# Altium schematic sheet C-01 CPU PWR.SchDoc
size 513 x 386 mm
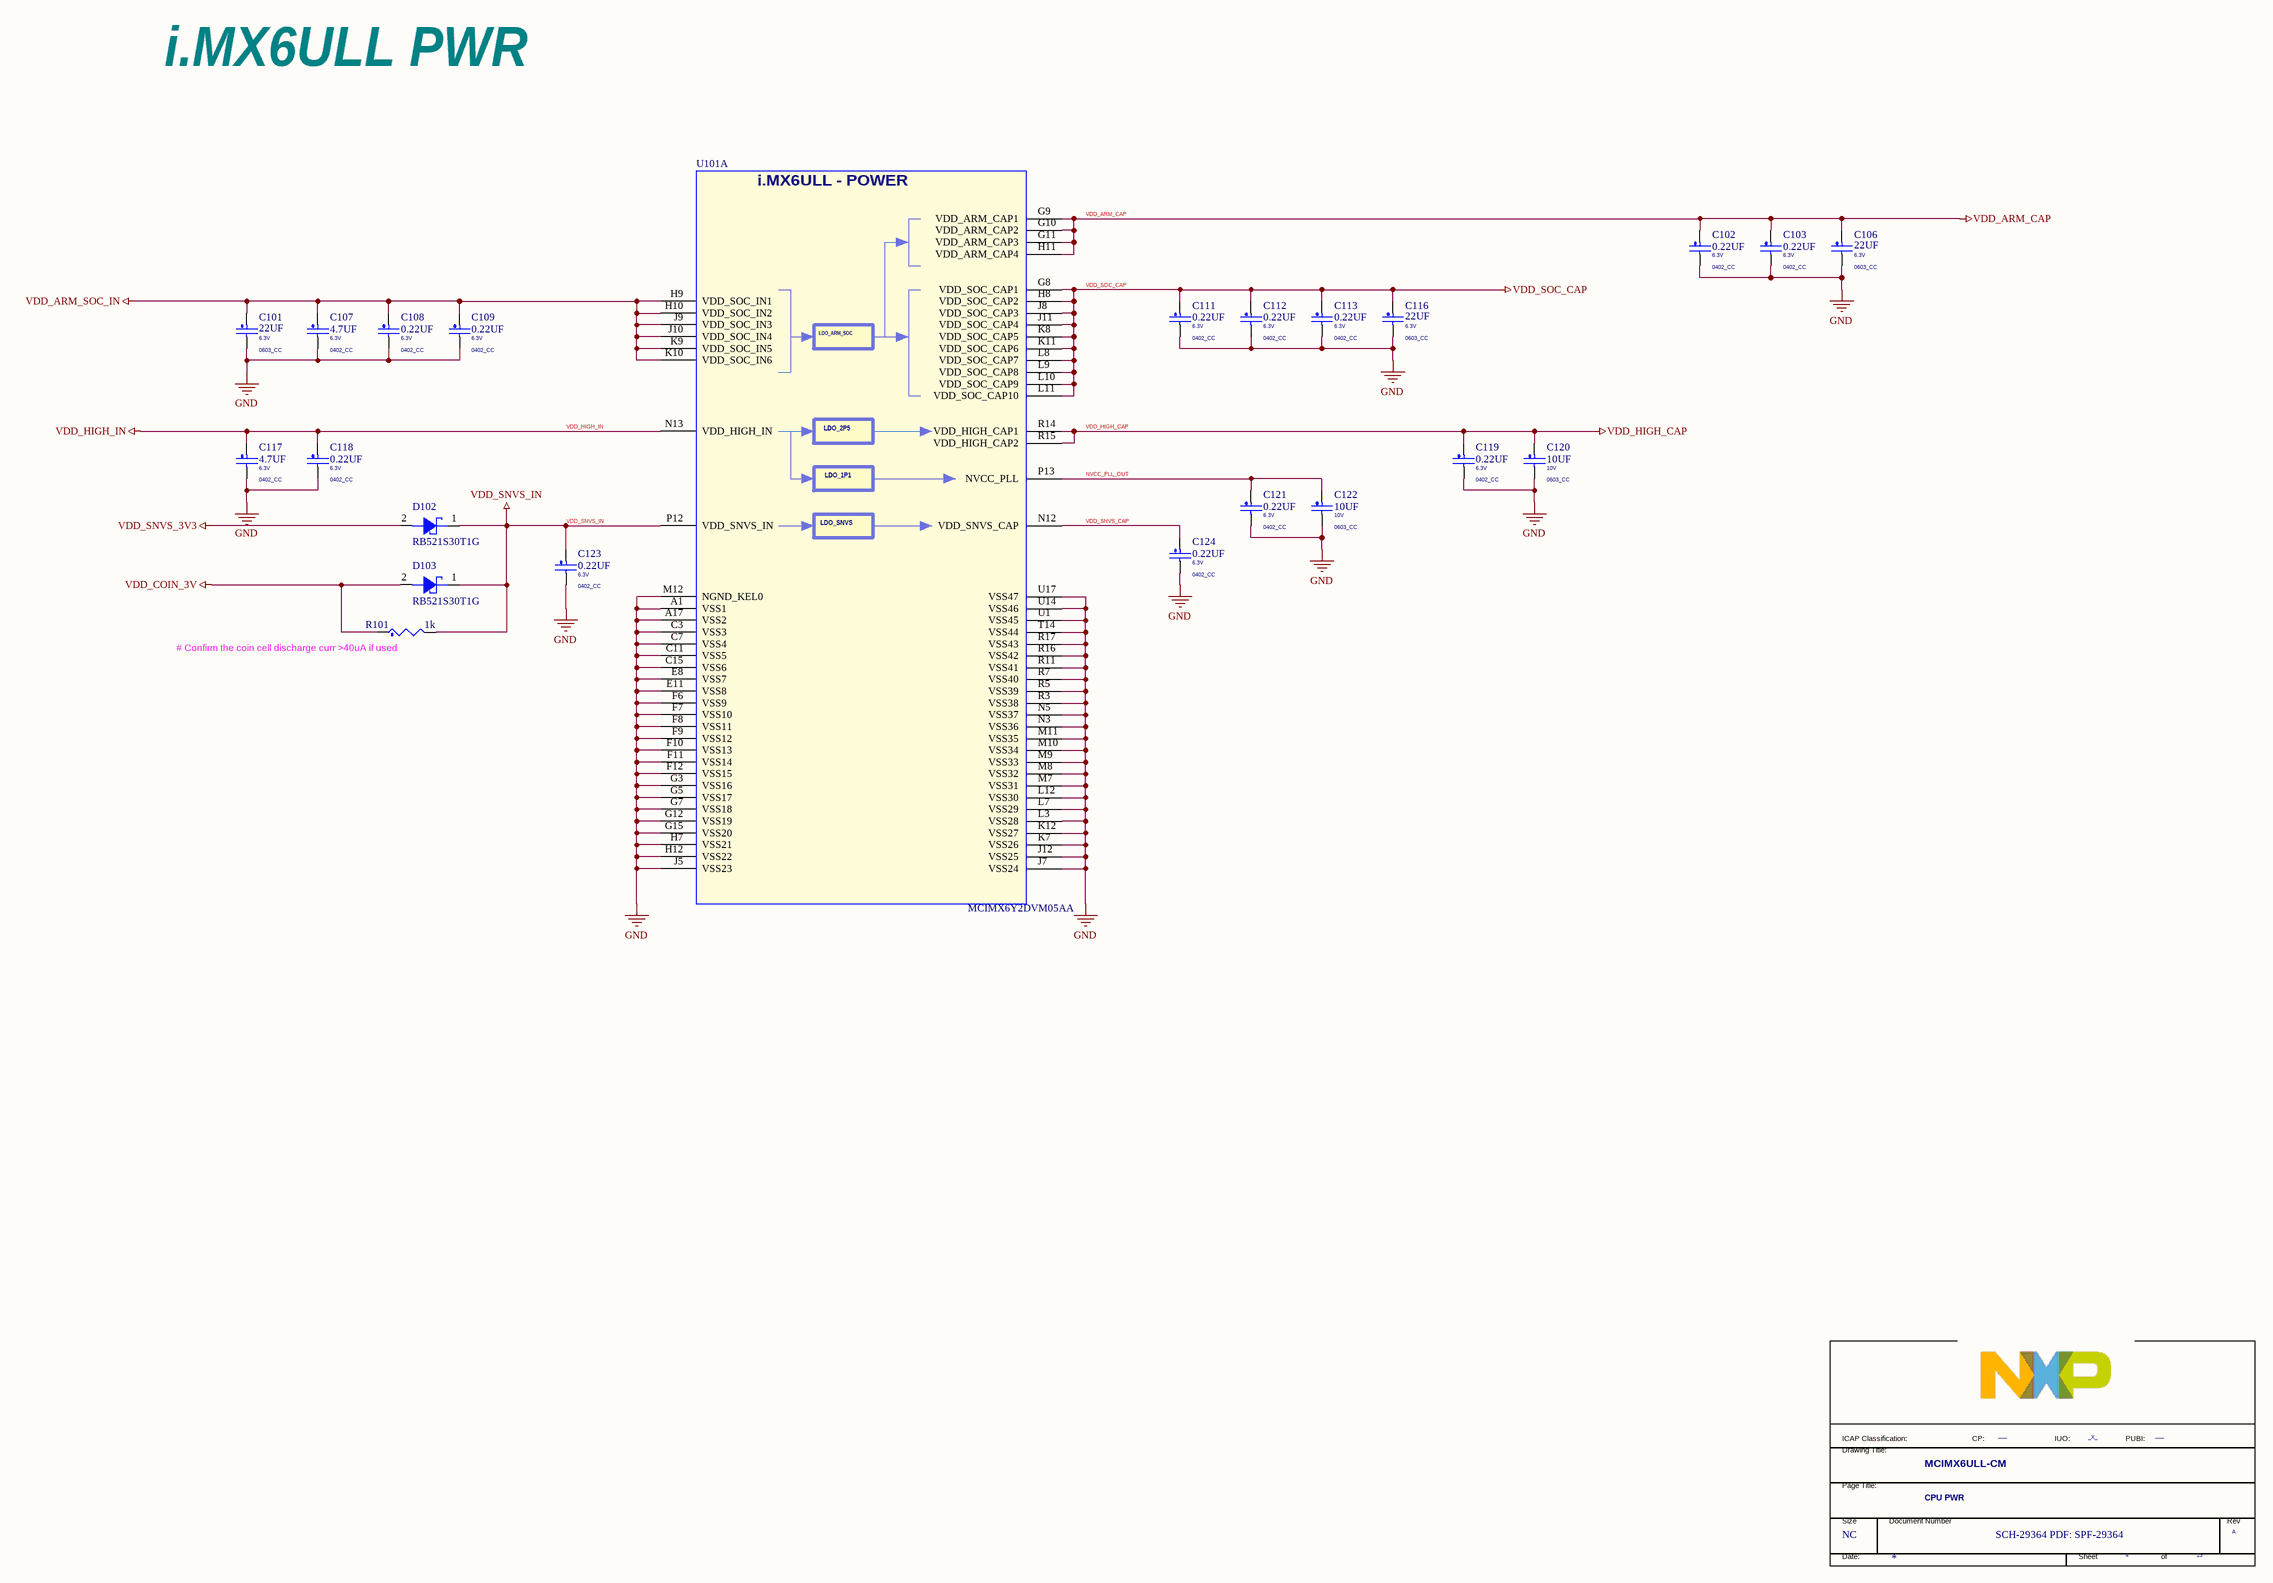
[diagram p0: C-01 CPU PWR.SchDoc]

## Parts
*  FIUO: _X_  PUBI: ___  Doc: SCH-29364 PDF: SPF-29364  RevCode: A  Title: MCIMX6ULL-CM  Page Size: NC  Page Number: 4  Page Count: 13  PageTitle: CPU PWR  (hidden comment: TitleBlock_FS)  (graphical)
C101  22UF  voltage rating: 6.3V  PCB Footprint: 0603_CC  [C0603_H0.8mm]  (net tie, no BOM)
C102  0.22UF  VOLTAGE: 6.3V  PCB Footprint: 0402_CC  [C0402_H0.5mm]
C103  0.22UF  VOLTAGE: 6.3V  PCB Footprint: 0402_CC  [C0402_H0.5mm]
C106  22UF  VOLTAGE: 6.3V  PCB Footprint: 0603_CC  [C0603_H0.8mm]
C107  4.7UF  voltage rating: 6.3V  PCB Footprint: 0402_CC  [C0402_H0.5mm]
C108  0.22UF  VOLTAGE: 6.3V  PCB Footprint: 0402_CC  [C0402_H0.5mm]
C109  0.22UF  VOLTAGE: 6.3V  PCB Footprint: 0402_CC  [C0402_H0.5mm]
C111  0.22UF  VOLTAGE: 6.3V  PCB Footprint: 0402_CC  [C0402_H0.5mm]
C112  0.22UF  VOLTAGE: 6.3V  PCB Footprint: 0402_CC  [C0402_H0.5mm]
C113  0.22UF  VOLTAGE: 6.3V  PCB Footprint: 0402_CC  [C0402_H0.5mm]
C116  22UF  VOLTAGE: 6.3V  PCB Footprint: 0603_CC  [C0603_H0.8mm]
C117  4.7UF  voltage rating: 6.3V  PCB Footprint: 0402_CC  [C0402_H0.5mm]
C118  0.22UF  VOLTAGE: 6.3V  PCB Footprint: 0402_CC  [C0402_H0.5mm]
C119  0.22UF  VOLTAGE: 6.3V  PCB Footprint: 0402_CC  [C0402_H0.5mm]
C120  10UF  VOLTAGE: 10V  PCB Footprint: 0603_CC  [C0603_H0.8mm]
C121  0.22UF  VOLTAGE: 6.3V  PCB Footprint: 0402_CC  [C0402_H0.5mm]
C122  10UF  VOLTAGE: 10V  PCB Footprint: 0603_CC  [C0603_H0.8mm]
C123  0.22UF  VOLTAGE: 6.3V  PCB Footprint: 0402_CC  [C0402_H0.5mm]
C124  0.22UF  VOLTAGE: 6.3V  PCB Footprint: 0402_CC  [C0402_H0.5mm]
D102  RB521S30T1G  [SOD-523_1.2x0.8mm]
D103  RB521S30T1G  [SOD-523_1.2x0.8mm]
R101  1k  [R0402_H0.35mm]
U101  MCIMX6Y2DVM05AA  [BGA289_14x14mm]  (part A of 11)

## Nets
GND: C101.2 C102.2 C103.2 C106.2 C107.2 C108.2 C109.2 C111.2 C112.2 C113.2 C116.2 C117.2 C118.2 C119.2 C120.2 C121.2 C122.2 C123.2 C124.2 U101.A1(VSS1) U101.A17(VSS2) U101.C3(VSS3) U101.C7(VSS4) U101.C11(VSS5) U101.C15(VSS6) U101.E8(VSS7) U101.E11(VSS8) U101.F6(VSS9) U101.F7(VSS10) U101.F8(VSS11) U101.F9(VSS12) U101.F10(VSS13) U101.F11(VSS14) U101.F12(VSS15) U101.G3(VSS16) U101.G5(VSS17) U101.G7(VSS18) U101.G12(VSS19) U101.G15(VSS20) U101.H7(VSS21) U101.H12(VSS22) U101.J5(VSS23) U101.J7(VSS24) U101.J12(VSS25) U101.K7(VSS26) U101.K12(VSS27) U101.L3(VSS28) U101.L7(VSS29) U101.L12(VSS30) U101.M7(VSS31) U101.M8(VSS32) U101.M9(VSS33) U101.M10(VSS34) U101.M11(VSS35) U101.M12(NGND_KEL0) U101.N3(VSS36) U101.N5(VSS37) U101.R3(VSS38) U101.R5(VSS39) U101.R7(VSS40) U101.R11(VSS41) U101.R16(VSS42) U101.R17(VSS43) U101.T14(VSS44) U101.U1(VSS45) U101.U14(VSS46) U101.U17(VSS47)
VDD_ARM_CAP: C102.1 C103.1 C106.1 U101.G9(VDD_ARM_CAP1) U101.G10(VDD_ARM_CAP2) U101.G11(VDD_ARM_CAP3) U101.H11(VDD_ARM_CAP4)
VDD_ARM_SOC_IN: C101.1 C107.1 C108.1 C109.1 U101.H9(VDD_SOC_IN1) U101.H10(VDD_SOC_IN2) U101.J9(VDD_SOC_IN3) U101.J10(VDD_SOC_IN4) U101.K9(VDD_SOC_IN5) U101.K10(VDD_SOC_IN6)
VDD_COIN_3V: D103.2(A) R101.1
VDD_HIGH_CAP: C119.1 C120.1 U101.R14(VDD_HIGH_CAP1) U101.R15(VDD_HIGH_CAP2)
VDD_HIGH_IN: C117.1 C118.1 U101.N13(VDD_HIGH_IN)
VDD_SNVS_3V3: D102.2(A)
VDD_SNVS_IN: C123.1 D102.1(C) D103.1(C) R101.2 U101.P12(VDD_SNVS_IN)
VDD_SOC_CAP: C111.1 C112.1 C113.1 C116.1 U101.G8(VDD_SOC_CAP1) U101.H8(VDD_SOC_CAP2) U101.J8(VDD_SOC_CAP3) U101.J11(VDD_SOC_CAP4) U101.K8(VDD_SOC_CAP5) U101.K11(VDD_SOC_CAP6) U101.L8(VDD_SOC_CAP7) U101.L9(VDD_SOC_CAP8) U101.L10(VDD_SOC_CAP9) U101.L11(VDD_SOC_CAP10)
NVCC_PLL_OUT: C121.1 C122.1 U101.P13(NVCC_PLL)
VDD_SNVS_CAP: C124.1 U101.N12(VDD_SNVS_CAP)

## Notes on the sheet
- i.MX6ULL PWR
- (near R101) # Confirm the coin cell discharge curr >40uA if used
- (in symbol MCIMX6Y2DVM05AA_PBGA_289P, part A) i.MX6ULL - POWER; LDO_ARM_SOC; LDO_2P5; LDO_1P1; LDO_SNVS
- (in symbol TitleBlock_FS) ICAP Classification:; CP:; IUO:; PUBI:; Drawing Title:; Page Title:; Size; Document Number; Rev; Date:; Sheet; of

## Library data of the parts
* = TitleBlock_FS: OrgAddr2: Austin, TX 78735-8598; OrgAddr1: 6501 William Cannon Drive West; OrgName: Freescale Semiconductor; FCP: ___; Page Create Date: March  8, 1995; Page Modify Date: *
C101 C106 = CAP_NP: CAP CER 22UF 6.3V 20% X5R 0603; CLASS: DISCRETE; FPLIST: CC0603_OV,CC0603,0603_CC; CAD_APPROVED: Yes; MFG_PN01: CL10A226MQ8NRNE; MFG_NAME01: Samsung; AGILE_PN: 150-78467; HEIGHT: 1MM; ROHS: Yes; Tolerance: 20%
  C101: VOLTAGE: 6.3V
  C106: voltage rating: 6.3V
C102 C103 C108 C109 C118 C119 C123 = CAP_NP: CAP CER 0.22UF 6.3V 20% X5R 0402; CLASS: DISCRETE; FPLIST: CC0402_25,CC0402_HD,0402_CC; CAD_APPROVED: Yes; MFG_PN01: C0402C224M9PAC; MFG_NAME01: KEMET; AGILE_PN: 150-76271; HEIGHT: 0.55MM; ROHS: Yes; Tolerance: 20%
C107 C117 = CAP_NP: CAP CER 4.7UF 6.3V 20% X5R 0402; CLASS: DISCRETE; FPLIST: CC0402_25,CC0402_HD,0402_CC; CAD_APPROVED: Yes; MFG_PN01: C0402X5R6R3-475MNP; MFG_NAME01: VENKEL COMPANY; AGILE_PN: 150-78463; HEIGHT: 0.65MM; ROHS: Yes; Tolerance: 20%; VOLTAGE: 6.3V
C111-C113 C121 C124 = CAP_NP: CAP CER 0.22UF 6.3V 20% X5R 0402; CLASS: DISCRETE; AGILE_PN: 150-76271; MFG_NAME01: KEMET; MFG_PN01: C0402C224M9PAC; CAD_APPROVED: Yes; FPLIST: CC0402_25,CC0402_HD,0402_CC; Tolerance: 20%; ROHS: Yes; HEIGHT: 0.55MM
C116 = CAP_NP: CAP CER 22UF 6.3V 20% X5R 0603; CLASS: DISCRETE; AGILE_PN: 150-78467; MFG_NAME01: Samsung; MFG_PN01: CL10A226MQ8NRNE; CAD_APPROVED: Yes; FPLIST: CC0603_OV,CC0603,0603_CC; voltage rating: 6.3V; Tolerance: 20%; ROHS: Yes; HEIGHT: 1MM
C120 C122 = CAP_NP: CAP CER 10UF 10V 20% X5R 0603; CLASS: DISCRETE; FPLIST: CC0603_OV,CC0603,0603_CC; CAD_APPROVED: Yes; MFG_PN01: LMK107BJ106MALTD; MFG_NAME01: TAIYO YUDEN; AGILE_PN: 150-78609; HEIGHT: 1.016MM; ROHS: Yes
D102 D103 = DIODE_SCHTKY: DIODE SCH 200MA 30V AEC-Q101 SOD-523; CLASS: IC; PCB Footprint: sod_523; AGILE_PN: 480-78501; MFG_NAME01: On Semiconductor; CAD_APPROVED: Yes; MFG_PN01: RB521S30T1G; ROHS: Yes; HEIGHT: 0.7MM
R101 = RES: RES MF 1.0K 1/16W 5% 0402; CLASS: DISCRETE; PCB Footprint: 0402_CC; AGILE_PN: 470-75555; MFG_NAME01: VISHAY INTERTECHNOLOGY; MFG_PN01: CRCW04021K00JNED; CAD_APPROVED: Yes; FPLIST: RC0402_25,RC0402_HD,RC0402_X2,0402_CC; Tolerance: 5%; ROHS: Yes
U101 = MCIMX6Y2DVM05AA_PBGA_289P: IC CPU ARM COREA7 528MHZ 16BIT 1.5V PBGA289; PCB Footprint: BGA289_0P8_14X14; AGILE_PN: TMP-WF-27909; MFG_NAME01: NXP SEMICONDUCTORS; PRE_APN: 330-77022; CAD_APPROVED: Yes; CLASS: IC; MFG_PN01: MCIMX6Y2DVM05AA; ROHS: Yes; HEIGHT: 1.32MM